# EAGLE design Breakout ADS1299 (EAGLE 7.5.0)
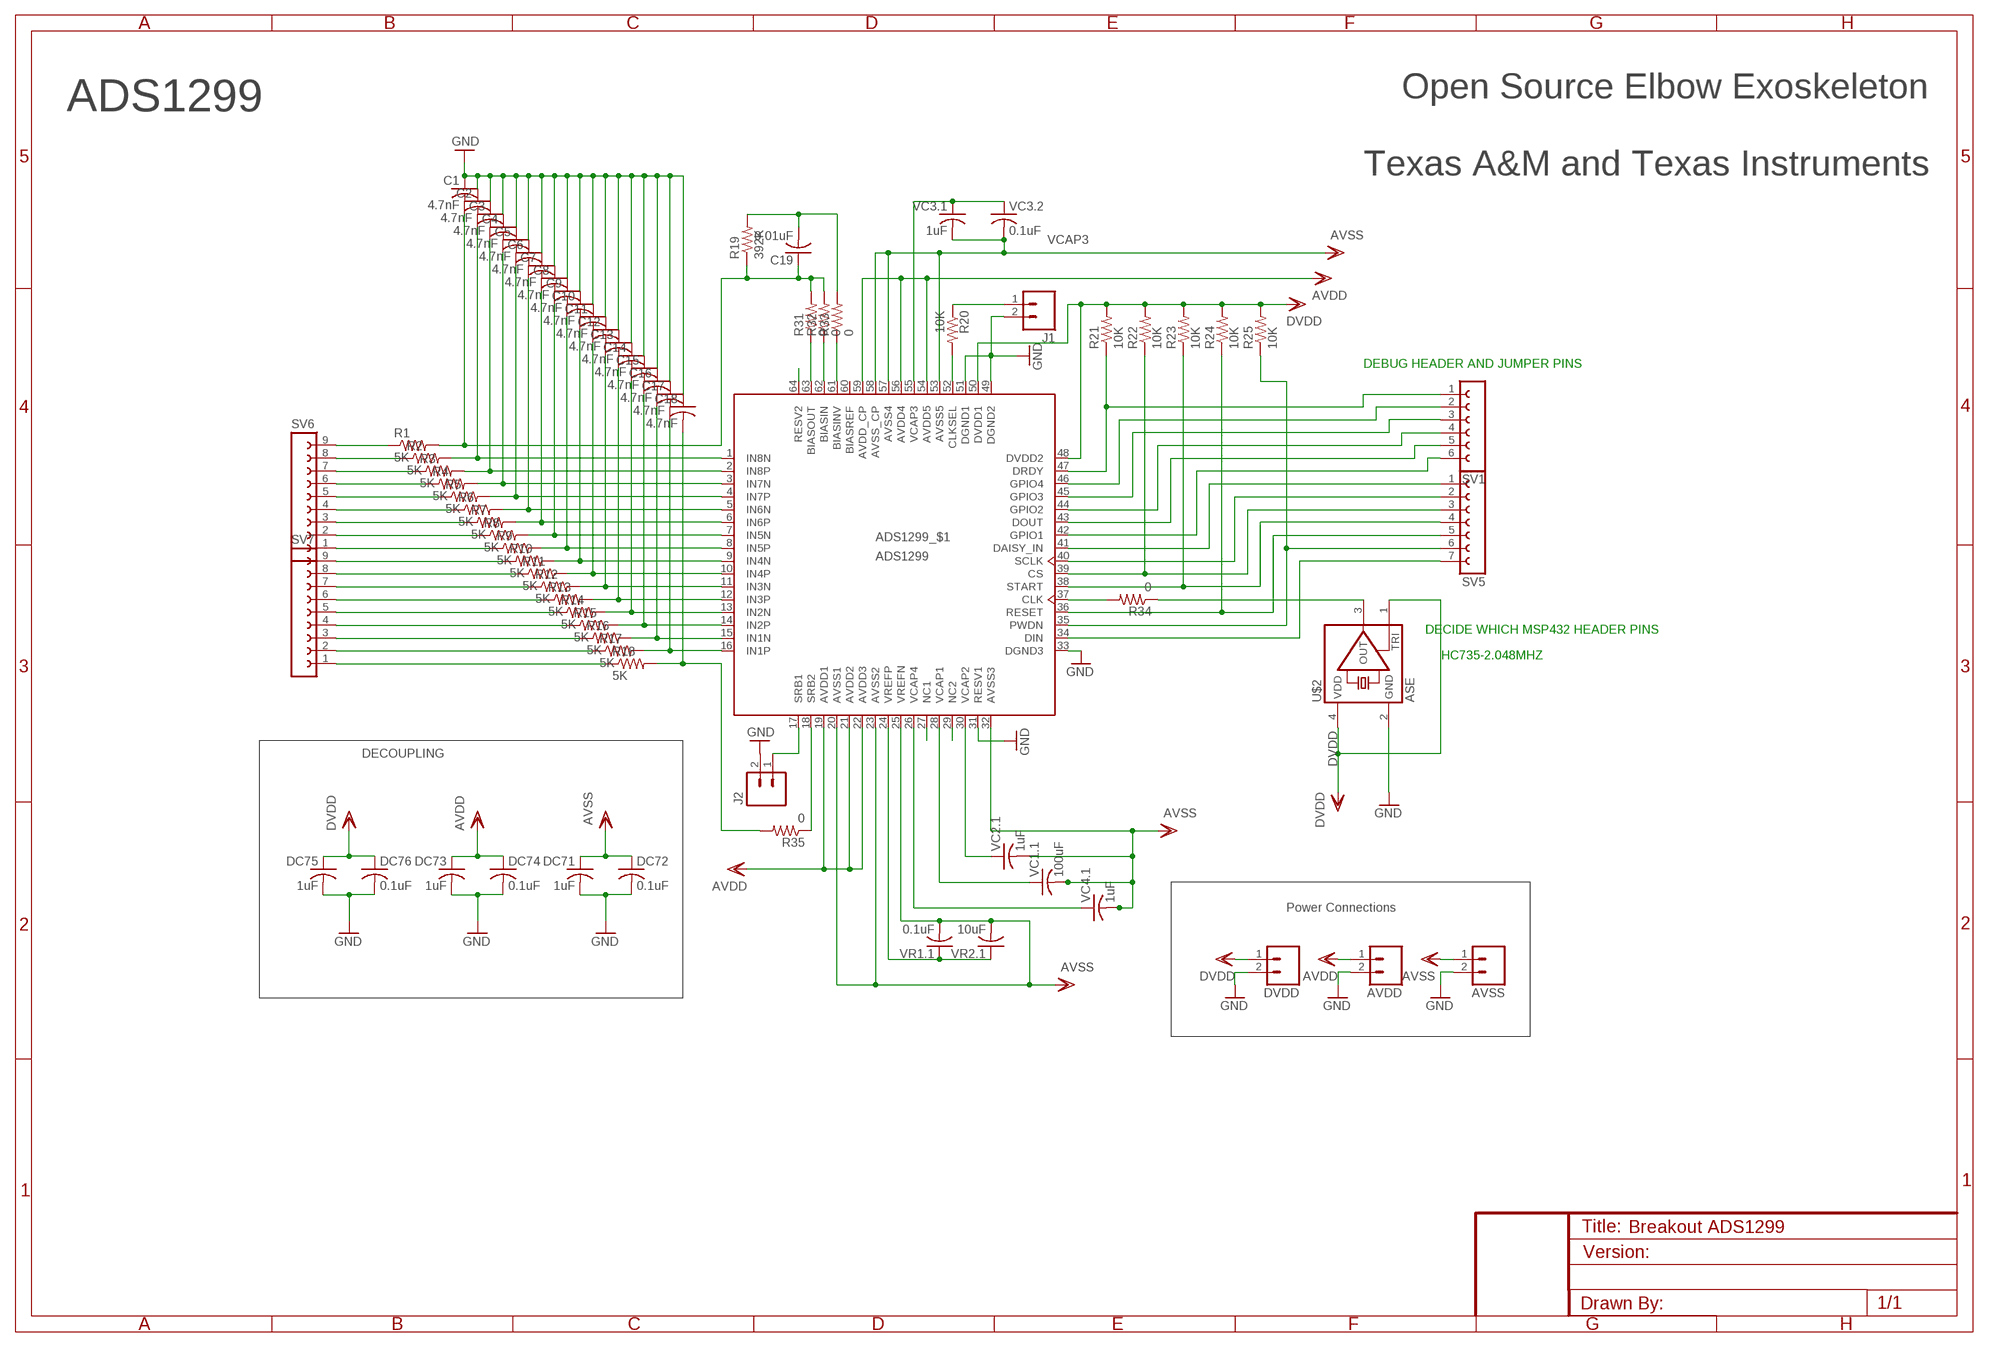
[diagram p0: schematic, sheet 1]

## Parts
ADS1  ADS1299  [PAG_S-PQFP-G64]
AVDD  M025MM  [SCREWTERMINAL-5MM-2]
AVSS  M025MM  [SCREWTERMINAL-5MM-2]
C1  4.7nF  C-USC0603  [C0603]
C2  4.7nF  C-USC0603  [C0603]
C3  4.7nF  C-USC0603  [C0603]
C4  4.7nF  C-USC0603  [C0603]
C5  4.7nF  C-USC0603  [C0603]
C6  4.7nF  C-USC0603  [C0603]
C7  4.7nF  C-USC0603  [C0603]
C8  4.7nF  C-USC0603  [C0603]
C9  4.7nF  C-USC0603  [C0603]
C10  4.7nF  C-USC0603  [C0603]
C11  4.7nF  C-USC0603  [C0603]
C12  4.7nF  C-USC0603  [C0603]
C13  4.7nF  C-USC0603  [C0603]
C14  4.7nF  C-USC0603  [C0603]
C15  4.7nF  C-USC0603  [C0603]
C16  4.7nF  C-USC0603  [C0603]
C17  4.7nF  C-USC0603  [C0603]
C18  4.7nF  C-USC0603  [C0603]
C19  0.01uF  C-USC0603  [C0603]
DC71  1uF  C-USC0603  [C0603]
DC72  0.1uF  C-USC0603  [C0603]
DC73  1uF  C-USC0603  [C0603]
DC74  0.1uF  C-USC0603  [C0603]
DC75  1uF  C-USC0603  [C0603]
DC76  0.1uF  C-USC0603  [C0603]
DVDD  M025MM  [SCREWTERMINAL-5MM-2]
J1  M02PTH  [1X02]
J2  M02PTH  [1X02]
R1  5K  R-US_R0603  [R0603]
R2  5K  R-US_R0603  [R0603]
R3  5K  R-US_R0603  [R0603]
R4  5K  R-US_R0603  [R0603]
R5  5K  R-US_R0603  [R0603]
R6  5K  R-US_R0603  [R0603]
R7  5K  R-US_R0603  [R0603]
R8  5K  R-US_R0603  [R0603]
R9  5K  R-US_R0603  [R0603]
R10  5K  R-US_R0603  [R0603]
R11  5K  R-US_R0603  [R0603]
R12  5K  R-US_R0603  [R0603]
R13  5K  R-US_R0603  [R0603]
R14  5K  R-US_R0603  [R0603]
R15  5K  R-US_R0603  [R0603]
R16  5K  R-US_R0603  [R0603]
R17  5K  R-US_R0603  [R0603]
R18  5K  R-US_R0603  [R0603]
R19  392K  R-US_R0603  [R0603]
R20  10K  R-US_R0603  [R0603]
R21  10K  R-US_R0603  [R0603]
R22  10K  R-US_R0603  [R0603]
R23  10K  R-US_R0603  [R0603]
R24  10K  R-US_R0603  [R0603]
R25  10K  R-US_R0603  [R0603]
R31  0  R-US_R0603  [R0603]
R32  0  R-US_R0603  [R0603]
R33  0  R-US_R0603  [R0603]
R34  0  R-US_R0603  [R0603]
R35  0  R-US_R0603  [R0603]
SV1  FE06-1  [FE06]
SV5  FE07-1  [FE07]
SV6  FE09-1  [FE09]
SV7  FE09-1  [FE09]
U$2  ASE  [ASE]
VC1.1  100uF  C-USC0603  [C0603]
VC2.1  1uF  C-USC0603  [C0603]
VC3.1  1uF  C-USC0603  [C0603]
VC3.2  0.1uF  C-USC0603  [C0603]
VC4.1  1uF  C-USC0603  [C0603]
VR1.1  0.1uF  C-USC0603  [C0603]
VR2.1  10uF  C-USC0603  [C0603]

## Nets
_CLK: R34.1 U$2.3(OUT)
_CS1: ADS1.39(CS) R22.1 SV5.3
_DRDY: ADS1.47(DRDY) R21.1 SV1.1
_PD: ADS1.35(PWDN) R25.1 SV5.6
_SRB2: C18.2 R18.2 R35.2
_STRT: ADS1.38(START) R23.1 SV5.4
AVDD: ADS1.19(AVDD1) ADS1.21(AVDD2) ADS1.22(AVDD3) ADS1.54(AVDD5) ADS1.56(AVDD4) ADS1.59(AVDD_CP) AVDD.1 DC73.1 DC74.1
AVSS: ADS1.20(AVSS1) ADS1.23(AVSS2) ADS1.25(VREFN) ADS1.32(AVSS3) ADS1.53(AVSS5) ADS1.57(AVSS4) ADS1.58(AVSS_CP) AVSS.1 DC71.1 DC72.1 VC1.1.2 VC2.1.2 VC3.1.2 VC3.2.2 VC4.1.2 VR1.1.2 VR2.1.2
BIASIN: ADS1.62(BIASIN) R32.1
BIASINV: ADS1.61(BIASINV) R33.1
BIASINV_1: C19.2 R19.2 R33.2
BIASOUT: ADS1.63(BIASOUT) R31.1
DAISY_IN: ADS1.41(DAISY_IN) SV5.1
DVDD: ADS1.48(DVDD2) ADS1.50(DVDD1) DC75.1 DC76.1 DVDD.1 R21.2 R22.2 R23.2 R24.2 R25.2 U$2.1(TRI) U$2.4(VDD)
GND: ADS1.31(RESV1) ADS1.33(DGND3) ADS1.49(DGND2) ADS1.51(DGND1) AVDD.2 AVSS.2 C1.1 C2.1 C3.1 C4.1 C5.1 C6.1 C7.1 C8.1 C9.1 C10.1 C11.1 C12.1 C13.1 C14.1 C15.1 C16.1 C17.1 C18.1 DC71.2 DC72.2 DC73.2 DC74.2 DC75.2 DC76.2 DVDD.2 J1.2 J2.2 U$2.2(GND)
GPIO1: ADS1.42(GPIO1) SV1.6
GPIO2: ADS1.44(GPIO2) SV1.4
GPIO3: ADS1.45(GPIO3) SV1.3
GPIO4: ADS1.46(GPIO4) SV1.2
N$1: ADS1.34(DIN) SV5.7
N$2: ADS1.18(SRB2) R35.1
N$3: ADS1.37(CLK) R34.2
N$4: ADS1.55(VCAP3) VC3.1.1 VC3.2.1
N$5: ADS1.3(IN7N) C4.2 R4.2
N$6: ADS1.1(IN8N) C2.2 R2.2
N$7: ADS1.52(CLKSEL) R20.2
N$8: ADS1.5(IN6N) C6.2 R6.2
N$9: J1.1 R20.1
N$10: ADS1.7(IN5N) C8.2 R8.2
N$11: ADS1.43(DOUT) SV1.5
N$12: ADS1.9(IN4N) C10.2 R10.2
N$13: C1.2 C19.1 R1.2 R19.1 R31.2 R32.2
N$14: ADS1.11(IN3N) C12.2 R12.2
N$15: ADS1.40(SCLK) SV5.2
N$16: ADS1.13(IN2N) C14.2 R14.2
N$18: ADS1.15(IN1N) C16.2 R16.2
N$30: ADS1.24(VREFP) VR1.1.1 VR2.1.1
N$31: ADS1.26(VCAP4) VC4.1.1
N$32: ADS1.28(VCAP1) VC1.1.1
N$33: ADS1.30(VCAP2) VC2.1.1
N$37: R1.1 SV6.9
N$38: R2.1 SV6.8
N$39: R3.1 SV6.7
N$40: R4.1 SV6.6
N$41: R5.1 SV6.5
N$42: R6.1 SV6.4
N$43: R7.1 SV6.3
N$44: R8.1 SV6.2
N$45: R9.1 SV6.1
N$46: R10.1 SV7.9
N$47: R11.1 SV7.8
N$48: R12.1 SV7.7
N$49: R13.1 SV7.6
N$50: R14.1 SV7.5
N$51: R15.1 SV7.4
N$52: R16.1 SV7.3
N$53: R17.1 SV7.2
N$54: R18.1 SV7.1
N$79: ADS1.2(IN8P) C3.2 R3.2
N$81: ADS1.4(IN7P) C5.2 R5.2
N$83: ADS1.6(IN6P) C7.2 R7.2
N$85: ADS1.8(IN5P) C9.2 R9.2
N$87: ADS1.10(IN4P) C11.2 R11.2
N$89: ADS1.12(IN3P) C13.2 R13.2
N$91: ADS1.14(IN2P) C15.2 R15.2
N$93: ADS1.16(IN1P) C17.2 R17.2
N$103: ADS1.27(NC1)
N$105: ADS1.29(NC2)
N$126: ADS1.64(RESV2)
RST: ADS1.36(RESET) R24.1 SV5.5
SRB1: ADS1.17(SRB1) J2.1
Unconnected: ADS1.60(BIASREF)

## Notes on the sheet
- Open Source Elbow Exoskeleton
- ADS1299
- Texas A&M and Texas Instruments
- VCAP3
- DEBUG HEADER AND JUMPER PINS
- DECIDE WHICH MSP432 HEADER PINS
- HC735-2.048MHZ
- DECOUPLING
- Power Connections

## Library data of the parts
ADS1 = ads1299:ADS1299: Low-Noise, 8-Channel, 24-Bit Analog Front-End for Biopotential Measurements Auto generated by make-symbol-device-package-bsdl.ulp Rev. 29 Source: http://www.ti.com/lit/ds/symlink/ads1299.pdf; MF: TEXAS INSTRUMENTS; MPN: ADS1299PAGR
AVDD AVSS DVDD = SparkFun-Connectors:M02: Standard 2-pin 0.1" header. Use with - straight break away headers ( PRT-00116) - right angle break away headers (PRT-00553) - swiss pins (PRT-00743) - machine pins (PRT-00117) - female headers (PRT-00115) Molex polarized connector foot print use with: PRT-08233 with associated crimp pins and housings. 2.54_SCREWTERM for use with PRT-10571. 3.5mm Screw Terminal footprints for PRT-08084 5mm Screw Terminal footprints for use with PRT-08432; STOREFRONT_ID: PRT-08432
C1-C19 VC2.1 VC3.1 VC3.2 VC4.1 VR1.1 VR2.1 = resistor:C-US: CAPACITOR, American symbol
DC71-DC76 VC1.1 = rcl:C-US: CAPACITOR, American symbol
J1 J2 = SparkFun-Connectors:M02: Standard 2-pin 0.1" header. Use with - straight break away headers ( PRT-00116) - right angle break away headers (PRT-00553) - swiss pins (PRT-00743) - machine pins (PRT-00117) - female headers (PRT-00115) Molex polarized connector foot print use with: PRT-08233 with associated crimp pins and housings. 2.54_SCREWTERM for use with PRT-10571. 3.5mm Screw Terminal footprints for PRT-08084 5mm Screw Terminal footprints for use with PRT-08432
R1-R25 R31-R35 = resistor:R-US_: RESISTOR, American symbol
SV1 = con-lsta:FE06-1: FEMALE HEADER; OC_FARNELL: unknown; OC_NEWARK: unknown
SV5 = con-lsta:FE07-1: FEMALE HEADER; OC_FARNELL: unknown; OC_NEWARK: unknown
SV6 SV7 = con-lsta:FE09-1: FEMALE HEADER; OC_FARNELL: unknown; OC_NEWARK: unknown
U$2 = crystal:ASE: 3.3Vdc CMOS SMD CRYSTAL CLOCK OSCILLATOR SOurce: www.abracon.com; OC_FARNELL: unknown; OC_NEWARK: unknown

## Board
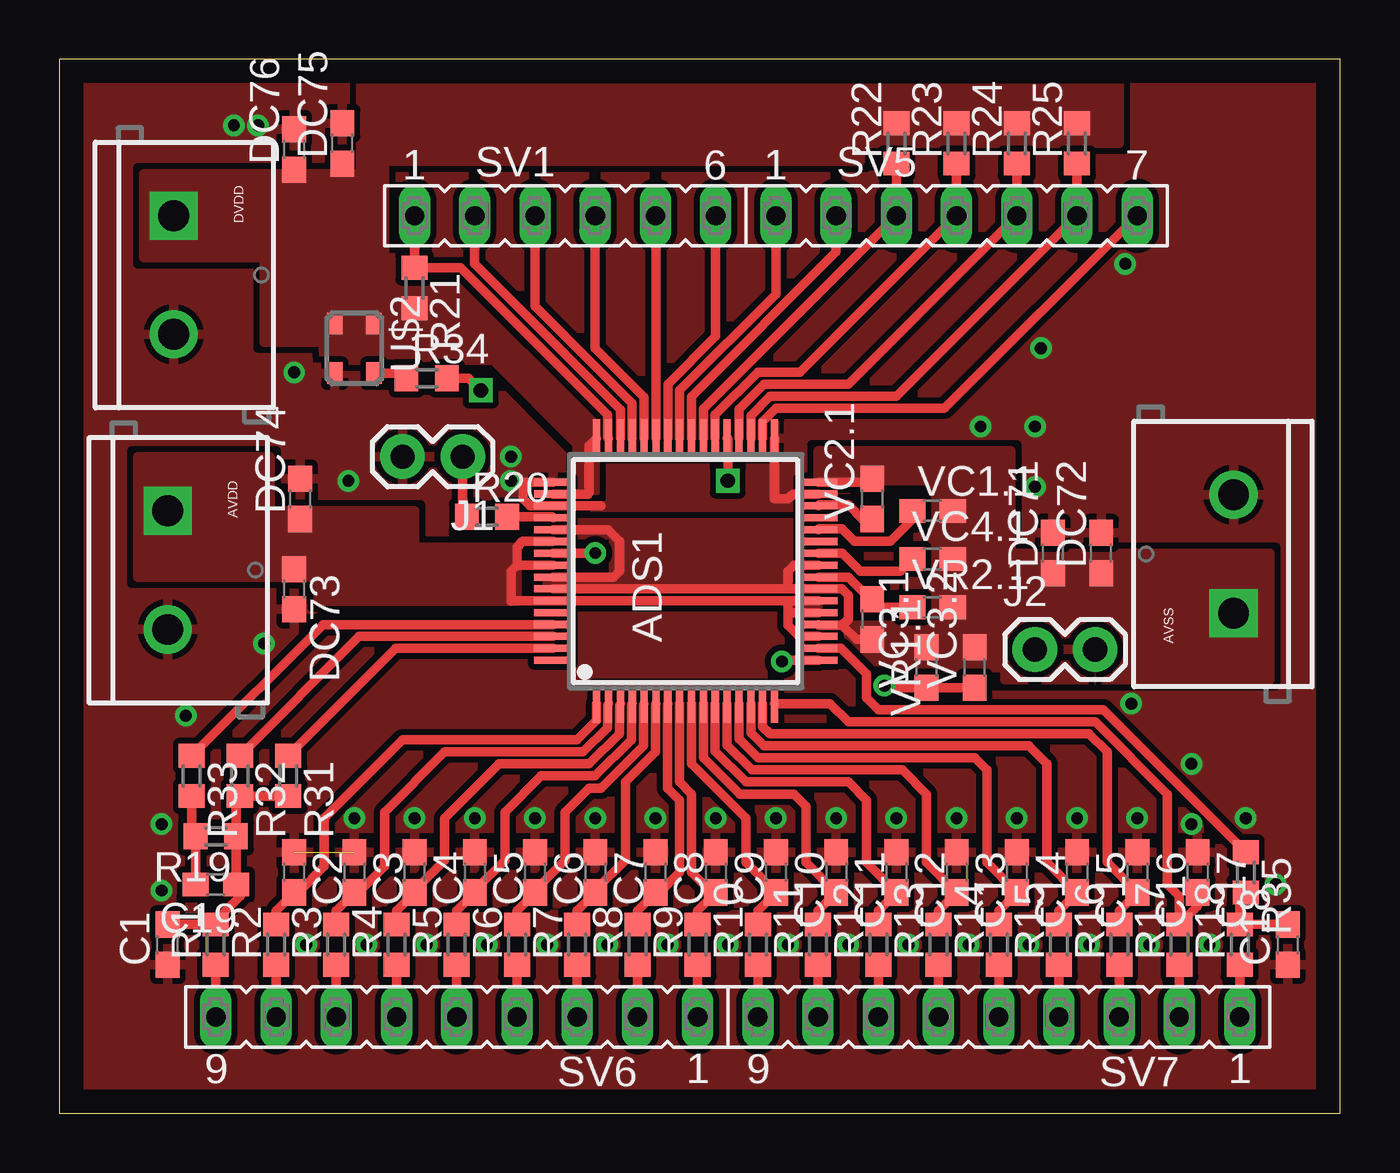
[diagram p1: board, top side]
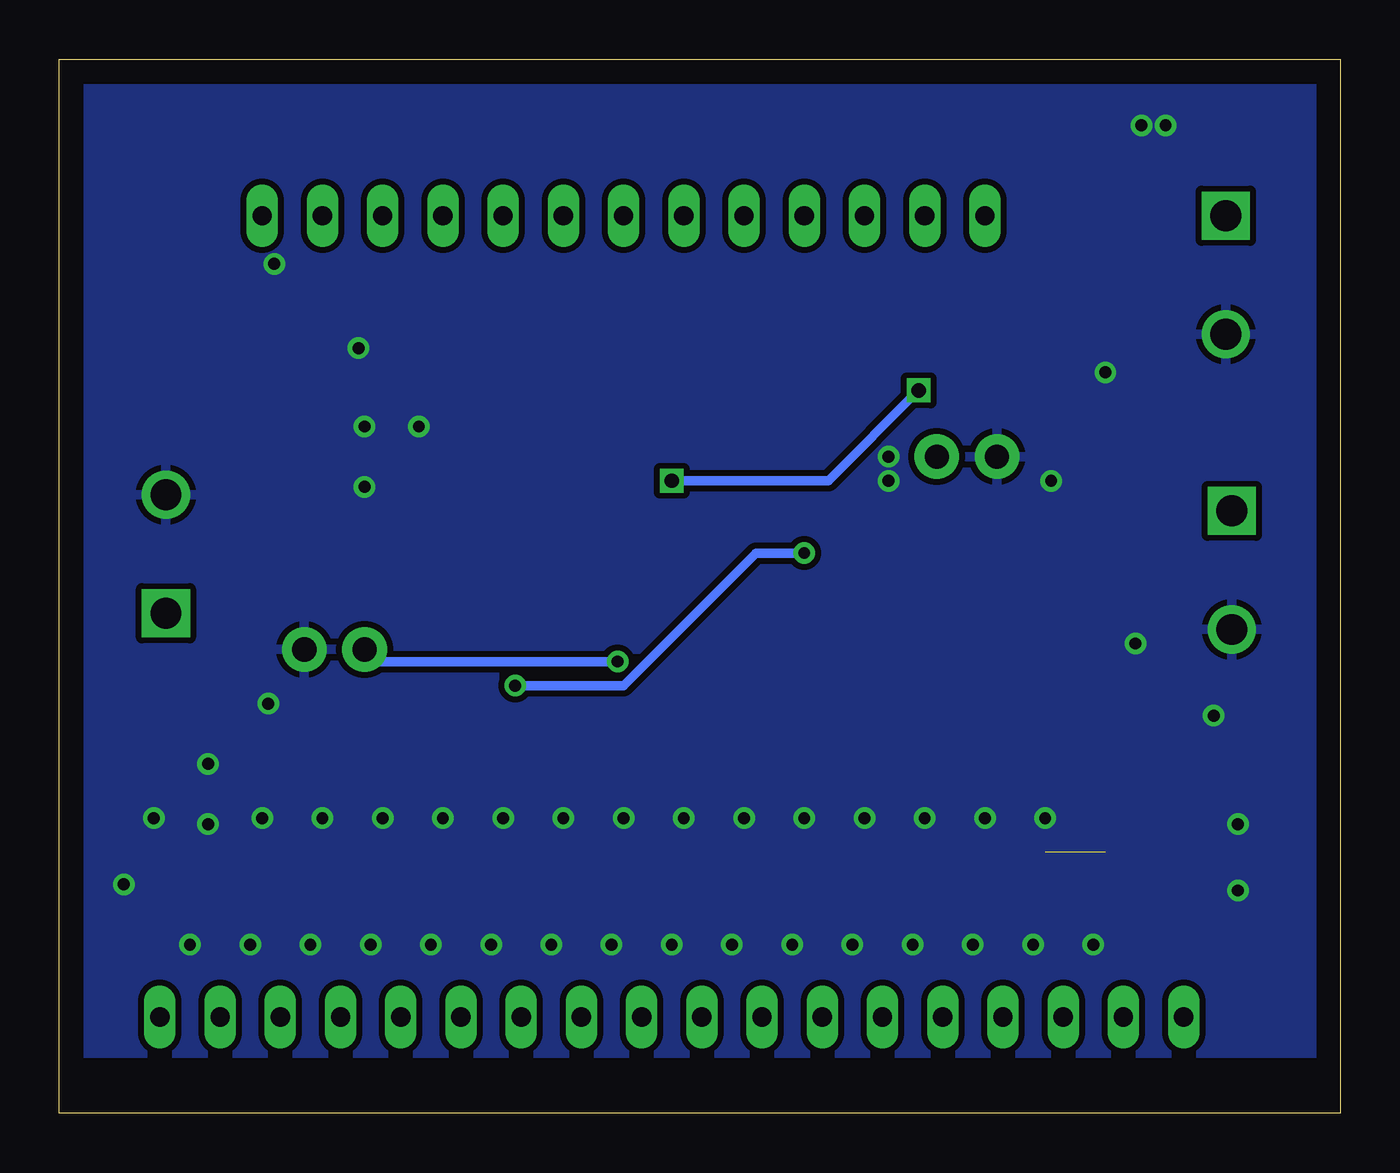
[diagram p2: board, bottom side, seen from below]

Size 54.03 x 44.44 mm. Coordinates in mm from the lower left corner, seen from the top.
Outline: 0,0 54.03,0 54.03,44.44 0,44.44 0,0
Copper layers (1*16): Top 0.035mm / dielectric 1.5mm / Bottom 0.035mm
Design rules "default": minimum track width 10mil, minimum drill 24mil, track to track 8mil, track to pad 8mil, pad to pad 8mil, via to via 8mil, smd to smd 8mil, copper to edge 40mil, drill to drill 8mil, minimum pad ring 10mil, minimum via ring 8mil, stop-mask expansion 4mil, vias tented up to drill 0mil, thermal gap 10mil

### Footprints (pad centres in the part's own frame; a part is rotated, then mirrored left to right if it is on the bottom)
PAG_S-PQFP-G64 = smd 1.6 x 0.3: 1 -5.6,3.75; 2 -5.6,3.25; 3 -5.6,2.75; 4 -5.6,2.25; 5 -5.6,1.75; 6 -5.6,1.25; 7 -5.6,0.75; 8 -5.6,0.25; 9 -5.6,-0.25; 10 -5.6,-0.75; 11 -5.6,-1.25; 12 -5.6,-1.75; 13 -5.6,-2.25; 14 -5.6,-2.75; 15 -5.6,-3.25; 16 -5.6,-3.75; 33 5.6,-3.75; 34 5.6,-3.25; 35 5.6,-2.75; 36 5.6,-2.25; 37 5.6,-1.75; 38 5.6,-1.25; 39 5.6,-0.75; 40 5.6,-0.25; 41 5.6,0.25; 42 5.6,0.75; 43 5.6,1.25; 44 5.6,1.75; 45 5.6,2.25; 46 5.6,2.75; 47 5.6,3.25; 48 5.6,3.75 | smd 0.3 x 1.6: 17 -3.75,-5.6; 18 -3.25,-5.6; 19 -2.75,-5.6; 20 -2.25,-5.6; 21 -1.75,-5.6; 22 -1.25,-5.6; 23 -0.75,-5.6; 24 -0.25,-5.6; 25 0.25,-5.6; 26 0.75,-5.6; 27 1.25,-5.6; 28 1.75,-5.6; 29 2.25,-5.6; 30 2.75,-5.6; 31 3.25,-5.6; 32 3.75,-5.6; 49 3.75,5.6; 50 3.25,5.6; 51 2.75,5.6; 52 2.25,5.6; 53 1.75,5.6; 54 1.25,5.6; 55 0.75,5.6; 56 0.25,5.6; 57 -0.25,5.6; 58 -0.75,5.6; 59 -1.25,5.6; 60 -1.75,5.6; 61 -2.25,5.6; 62 -2.75,5.6; 63 -3.25,5.6; 64 -3.75,5.6
SCREWTERMINAL-5MM-2 = drill 1.3 pad 2.032 square: 1 0,0 | drill 1.3 pad 2.032: 2 5,0
C0603 = smd 1.1 x 1: 1 -0.85,0; 2 0.85,0
1X02 = drill 1.016 pad 1.88: 1 0,0; 2 2.54,0
R0603 = smd 1 x 1.1: 1 -0.85,0; 2 0.85,0
FE06 = drill 0.813 long: 1 -6.35,0; 2 -3.81,0; 3 -1.27,0; 4 1.27,0; 5 3.81,0; 6 6.35,0
FE07 = drill 0.813 long: 1 -7.62,0; 2 -5.08,0; 3 -2.54,0; 4 0,0; 5 2.54,0; 6 5.08,0; 7 7.62,0
FE09 = drill 0.813 long: 1 -10.16,0; 2 -7.62,0; 3 -5.08,0; 4 -2.54,0; 5 0,0; 6 2.54,0; 7 5.08,0; 8 7.62,0; 9 10.16,0
ASE = smd 0.9 x 0.65: 1 -1.05,-0.825; 2 1.05,-0.825; 3 1.05,0.825; 4 -1.05,0.825

### Placement (x,y rotation side)
ADS1  26.42,22.86 90 top
AVDD  4.57,25.4 270 top
AVSS  49.53,21.08 90 top
C1  4.57,7.11 90 top
C2  9.91,10.16 270 top
C3  12.45,10.16 270 top
C4  14.99,10.16 270 top
C5  17.53,10.16 270 top
C6  20.07,10.16 270 top
C7  22.61,10.16 270 top
C8  25.15,10.16 270 top
C9  27.69,10.16 270 top
C10  30.23,10.16 270 top
C11  32.77,10.16 270 top
C12  35.31,10.16 270 top
C13  37.85,10.16 270 top
C14  40.39,10.16 270 top
C15  42.93,10.16 270 top
C16  45.47,10.16 270 top
C17  48.01,10.16 270 top
C18  51.82,7.11 90 top
C19  6.6,9.65 180 top
DC71  41.91,23.62 90 top
DC72  43.94,23.62 90 top
DC73  9.91,22.1 270 top
DC74  10.16,25.91 90 top
DC75  11.94,40.89 90 top
DC76  9.91,40.64 90 top
DVDD  4.83,37.85 270 top
J1  17.02,27.69 180 top
J2  41.15,19.56 0 top
R1  6.6,7.11 90 top
R2  9.14,7.11 90 top
R3  11.68,7.11 90 top
R4  14.22,7.11 90 top
R5  16.76,7.11 90 top
R6  19.3,7.11 90 top
R7  21.84,7.11 90 top
R8  24.38,7.11 90 top
R9  26.92,7.11 90 top
R10  29.46,7.11 90 top
R11  32,7.11 90 top
R12  34.54,7.11 90 top
R13  37.08,7.11 90 top
R14  39.62,7.11 90 top
R15  42.16,7.11 90 top
R16  44.7,7.11 90 top
R17  47.24,7.11 90 top
R18  49.78,7.11 90 top
R19  6.6,11.68 180 top
R20  18.03,25.15 0 top
R21  14.99,34.8 270 top
R22  35.31,40.89 90 top
R23  37.85,40.89 90 top
R24  40.39,40.89 90 top
R25  42.93,40.89 90 top
R31  9.65,14.22 270 top
R32  7.62,14.22 270 top
R33  5.59,14.22 270 top
R34  15.49,30.99 0 top
R35  50.04,10.16 270 top
SV1  21.34,37.85 0 top
SV5  37.85,37.85 0 top
SV6  16.76,4.06 180 top
SV7  39.62,4.06 180 top
U$2  12.45,32.26 270 top
VC1.1  36.83,25.4 0 top
VC2.1  34.29,25.91 90 top
VC3.1  36.58,18.8 90 top
VC3.2  38.61,18.8 90 top
VC4.1  36.83,23.37 0 top
VR1.1  34.29,20.83 270 top
VR2.1  36.83,21.34 0 top

### Tracks (layer width: path | path; a pad name or v marks a point on that pad's centre or on a via)
_CLK
  Top 0.406: U$2.3 14.42,31.21 R34.1
_CS1
  Top 0.406: ADS1.39 27.17,29.71 SV5.3 R22.1
_DRDY
  Top 0.406: SV1.1 R21.1 16.93,35.65 23.11,29.46 23.11,28.51 ADS1.47
_PD
  Top 0.406: ADS1.35 29.17,29.42 29.97,30.23 35.31,30.23 SV5.6 R25.1
_SRB2
  Top 0.406: C18.2 R18.2 49.78,9.06 R35.2
_STRT
  Top 0.406: ADS1.38 27.67,29.44 29.46,31.24 31.24,31.24 SV5.4 R23.1
AVDD
  Top 0.406: 19.3,23.11 ADS1.56 | ADS1.54 19.54,24.11 19.3,23.88 19.3,23.11 | 19.3,23.11 19.05,22.86 19.05,21.59 19.07,21.61 ADS1.59 30.73,21.61 | 30.73,21.61 ADS1.22 | ADS1.19 31.2,20.11 30.73,20.57 30.73,21.08 | 30.73,21.08 30.73,21.61 | ADS1.21 30.76,21.11 30.73,21.08
  pour Top (isolate 0.254, no thermals): 3.3,27.69 8.89,27.69 8.89,25.4 14.99,25.4 14.99,23.88 19.3,23.88 19.3,21.59 10.92,21.59 10.92,22.61 3.3,22.61
  pour Top (isolate 0.254, no thermals): 30.73,21.08 32,21.08 32,21.59 30.73,21.59
AVSS
  Top 0.406: VR1.1.2 33.62,19.98 33.02,20.57 | 33.02,20.57 32.05,20.57 ADS1.20 | ADS1.32 34.29,26.61 VC2.1.2 | ADS1.53 23.14,24.61 23.62,24.13 23.62,22.86 23.37,22.61 ADS1.57 | ADS1.58 30.73,22.11 | 30.73,22.11 ADS1.23 33.01,22.11 33.27,21.84 33.27,20.83 33.02,20.57 | ADS1.25 30.98,23.11 30.73,22.86 30.73,22.11
  pour Top (isolate 0.254, no thermals): 32,26.67 32,27.94 40.13,27.94 40.13,23.62 51.05,23.62 51.05,18.29 39.88,18.29 39.88,18.8 35.31,18.8 35.05,19.05 34.29,19.05 33.27,20.07 33.27,20.57 36.83,20.57 36.83,26.67
  pour Top (isolate 0.254, no thermals): 20.57,22.1 20.57,22.61 30.73,22.61 30.73,22.1
  pour Top (isolate 0.254): 21.84,24.89 30.99,24.89 30.99,22.61 23.37,22.61 23.37,24.38 21.84,24.38
BIASIN
  Top 0.406: ADS1.62 12.66,20.11 R32.1
BIASINV
  Top 0.406: ADS1.61 11.12,20.61 R33.1
BIASINV_1
  Top 0.406: R33.2 5.59,11.85 R19.2 C19.2
BIASOUT
  Top 0.406: ADS1.63 14.19,19.61 R31.1
DAISY_IN
  Top 0.406: ADS1.41 26.17,30.48 30.23,34.54 SV5.1
DVDD
  Top 0.406: ADS1.50 22.3,26.11 22.35,26.16 22.35,28.15 ADS1.48
  pour Top (isolate 0.254, no thermals): 44.7,40.89 44.7,43.69 12.7,43.69 12.7,39.62 3.56,39.62 3.56,36.07 8.64,36.07 8.64,32.51 15.75,32.51 15.75,36.07 13.72,36.07 13.72,40.13 33.78,40.13 33.78,40.89
  pour Top (isolate 0.254, no thermals): 21.84,26.16 22.61,26.16 22.61,29.97 17.78,34.8 10.92,34.8 11.18,31.75 18.29,31.75 21.84,28.19
GND  (via drill 0.5)  (1 unrouted)
  Top 0.406: ADS1.31 30.94,26.11 30.73,25.91 30.17,25.91 ADS1.33 | 22.86,25.61 ADS1.51 19.86,25.61 19.56,25.91 19.56,26.61 | ADS1.49 19.56,26.61 | 19.56,26.61 19.36,26.61 19.3,26.67
  other vias: 12.45,12.45 14.99,12.45 17.53,12.45 20.07,12.45 22.61,12.45 25.15,12.45 27.69,12.45 30.23,12.45 32.77,12.45 35.31,12.45 37.85,12.45 40.39,12.45 42.93,12.45 45.47,12.45 47.75,12.19 19.05,26.67 19.05,27.69 10.41,7.11 12.95,7.11 15.49,7.11 18.03,7.11 20.57,7.11 23.11,7.11 25.65,7.11 28.19,7.11 30.73,7.11 33.27,7.11 35.81,7.11 38.35,7.11 40.89,7.11 43.43,7.11 45.97,7.11 48.51,7.11 8.38,41.66 7.37,41.66 41.4,32.26 44.96,35.81 12.19,26.67 9.91,31.24 4.32,9.4 4.32,12.19 5.33,16.76 8.64,19.81 51.31,9.65 50.04,12.45 47.75,14.73 45.21,17.27 41.15,26.42 41.15,28.96 38.86,28.96
  pour Top (isolate 0.254, rank 6): 0,0 54.1,0 52.83,43.43 0.76,44.2
  pour Bottom (isolate 0.254): 1.02,43.43 53.09,43.43 53.09,2.54 1.02,2.54
GPIO1
  Top 0.406: ADS1.42 25.67,30.75 27.69,32.77 SV1.6
GPIO2
  Top 0.406: ADS1.44 24.67,30.2 22.61,32.26 SV1.4
GPIO3
  Top 0.406: ADS1.45 24.17,29.94 20.07,34.04 SV1.3
GPIO4
  Top 0.406: ADS1.46 23.67,29.67 17.53,35.81 SV1.2
N$1
  Top 0.406: ADS1.34 29.67,29.16 30.23,29.72 37.34,29.72 SV5.7
N$2
  Top 0.406: ADS1.18 32.97,19.61 34.04,18.54 34.04,17.53 34.54,17.02 44.03,17.02 R35.1
N$3  (via drill 0.6)
  Top 0.406: R34.2 17.27,30.99 v17.78,30.48 | v28.19,26.67 28.19,28.43 ADS1.37
  Bottom 0.406: v17.78,30.48 21.59,26.67 v28.19,26.67
N$4  (via drill 0.5)
  Top 0.406: VC3.2.1 VC3.1.1 34.89,17.95 v34.8,18.03 | v22.61,23.62 20.83,23.62 ADS1.55
  Bottom 0.406: v34.8,18.03 30.23,18.03 24.64,23.62 v22.61,23.62
N$5
  Top 0.406: R4.2 14.22,8.55 C4.2 14.99,9.4 16.26,10.67 16.26,12.45 18.54,14.73 22.35,14.73 23.62,16 23.62,17.22 ADS1.3
N$6
  Top 0.406: R2.2 9.14,8.55 C2.2 10.07,9.31 11.18,10.41 11.18,12.45 14.48,15.75 21.84,15.75 22.67,16.57 ADS1.1
N$7
  Top 0.406: R20.2 20.78,25.15 ADS1.52
N$8
  Top 0.406: R6.2 19.3,8.55 C6.2 20.07,9.4 21.34,10.67 21.34,12.7 22.35,13.72 22.86,13.72 24.64,15.49 24.64,17.23 ADS1.5
N$9
  Top 0.406: J1.1 17.02,25.31 R20.1
N$10
  Top 0.406: R8.2 24.38,8.55 C8.2 25.31,9.31 26.16,10.16 26.16,13.21 25.65,13.72 25.65,17.25 ADS1.7
N$11
  Top 0.406: ADS1.43 25.17,37.83 SV1.5
N$12
  Top 0.406: R10.2 29.46,8.55 C10.2 28.96,10.58 28.96,12.45 26.67,14.74 ADS1.9
N$13
  Top 0.406: C1.2 R1.2 6.6,8.13 7.62,9.14 7.62,9.49 C19.1 R19.1 7.45,13.21 R32.2 R31.2
N$14
  Top 0.406: R12.2 34.54,8.55 C12.2 34.04,10.58 34.04,13.21 33.27,13.97 28.96,13.97 27.67,15.26 ADS1.11
N$15
  Top 0.406: ADS1.40 26.67,30.22 32.77,36.32 SV5.2
N$16
  Top 0.406: ADS1.13 28.67,15.78 29.46,14.99 38.61,14.99 39.12,14.48 39.12,10.58 C14.2 39.62,8.55 R14.2
N$18
  Top 0.406: ADS1.15 29.67,16.31 29.97,16 43.43,16 44.2,15.24 44.2,10.58 C16.2 44.7,8.55 R16.2
N$30
  Top 0.406: VR2.1.1 34.63,21.34 VR1.1.1 34.2,21.68 33.27,22.61 ADS1.24
N$31
  Top 0.406: ADS1.26 33.03,23.61 33.78,22.86 35.47,22.86 VC4.1.1
N$32
  Top 0.406: VC1.1.1 35.98,25.06 35.05,24.13 33.53,24.13 33.02,24.64 32.04,24.64 ADS1.28
N$33
  Top 0.406: VC2.1.1 33.87,25.06 33.27,25.65 32.06,25.65 ADS1.30
N$37
  Top 0.406: SV6.9 R1.1
N$38
  Top 0.406: SV6.8 R2.1
N$39
  Top 0.406: SV6.7 R3.1
N$40
  Top 0.406: SV6.6 R4.1
N$41
  Top 0.406: SV6.5 R5.1
N$42
  Top 0.406: SV6.4 R6.1
N$43
  Top 0.406: SV6.3 R7.1
N$44
  Top 0.406: SV6.2 R8.1
N$45
  Top 0.406: SV6.1 R9.1
N$46
  Top 0.406: SV7.9 R10.1
N$47
  Top 0.406: SV7.8 R11.1
N$48
  Top 0.406: SV7.7 R12.1
N$49
  Top 0.406: SV7.6 R13.1
N$50
  Top 0.406: SV7.5 R14.1
N$51
  Top 0.406: SV7.4 R15.1
N$52
  Top 0.406: SV7.3 R16.1
N$53
  Top 0.406: SV7.2 R17.1
N$54
  Top 0.406: SV7.1 R18.1
N$79
  Top 0.406: R3.2 11.68,8.55 C3.2 12.61,9.31 13.72,10.41 13.72,12.7 16.26,15.24 22.1,15.24 23.11,16.26 23.11,17.21 ADS1.2
N$81
  Top 0.406: R5.2 16.76,8.55 C5.2 17.53,9.4 18.8,10.67 18.8,12.7 20.32,14.22 22.61,14.22 24.13,15.75 24.13,17.22 ADS1.4
N$83
  Top 0.406: R7.2 21.84,8.55 C7.2 22.61,9.4 23.88,10.67 23.88,13.97 25.15,15.24 25.15,17.24 ADS1.6
N$85
  Top 0.406: R9.2 26.92,8.55 C9.2 27.52,9.31 26.67,10.16 26.67,13.46 26.16,13.97 ADS1.8
N$87
  Top 0.406: R11.2 32,8.55 C11.2 31.5,10.58 31.5,12.95 30.99,13.46 28.7,13.46 27.17,15 ADS1.10
N$89
  Top 0.406: ADS1.12 28.17,15.52 29.21,14.48 35.56,14.48 36.58,13.46 36.58,10.58 C13.2 37.08,8.55 R13.2
N$91
  Top 0.406: ADS1.14 29.17,16.05 29.72,15.49 40.89,15.49 41.66,14.73 41.66,10.58 C15.2 42.16,8.55 R15.2
N$93
  Top 0.406: C17.2 48.01,8.72 R17.2 47.24,9.14 46.74,9.65 46.74,13.46 43.69,16.51 33.27,16.51 32.51,17.27 30.18,17.27 ADS1.16
RST
  Top 0.406: ADS1.36 28.67,29.68 29.72,30.73 33.27,30.73 SV5.5 R24.1
SRB1  (via drill 0.5)
  Top 0.406: ADS1.17 30.54,19.11 v30.48,19.05
  Bottom 0.406: v30.48,19.05 40.64,19.05 J2.1